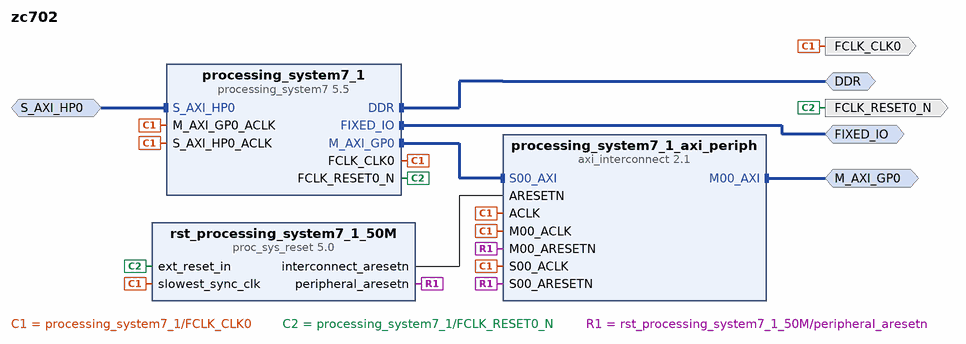
[diagram p0: block diagram of the top level]
# Vivado block design zc702, xc7z020clg484-1, Vivado 2017.2
create_bd_design zc702

create_bd_intf_port -mode Master -vlnv xilinx.com:interface:ddrx_rtl:1.0 DDR
create_bd_intf_port -mode Master -vlnv xilinx.com:display_processing_system7:fixedio_rtl:1.0 FIXED_IO
create_bd_intf_port -mode Master -vlnv xilinx.com:interface:aximm_rtl:1.0 M_AXI_GP0
set_property -dict [list \
  CONFIG.DATA_WIDTH 32 \
  CONFIG.PROTOCOL AXI4LITE \
  CONFIG.ADDR_WIDTH 32 \
  CONFIG.HAS_BURST 0 \
  CONFIG.HAS_LOCK 0 \
  CONFIG.HAS_CACHE 0 \
  CONFIG.HAS_QOS 0 \
  CONFIG.HAS_REGION 0 \
  CONFIG.NUM_READ_OUTSTANDING 8 \
  CONFIG.NUM_WRITE_OUTSTANDING 8 \
] [get_bd_intf_ports M_AXI_GP0]
create_bd_intf_port -mode Slave -vlnv xilinx.com:interface:aximm_rtl:1.0 S_AXI_HP0
set_property -dict [list \
  CONFIG.DATA_WIDTH 64 \
  CONFIG.PROTOCOL AXI3 \
  CONFIG.ID_WIDTH 6 \
  CONFIG.ADDR_WIDTH 32 \
  CONFIG.AWUSER_WIDTH 0 \
  CONFIG.ARUSER_WIDTH 0 \
  CONFIG.WUSER_WIDTH 0 \
  CONFIG.RUSER_WIDTH 0 \
  CONFIG.BUSER_WIDTH 0 \
  CONFIG.READ_WRITE_MODE READ_WRITE \
  CONFIG.HAS_BURST 1 \
  CONFIG.HAS_LOCK 1 \
  CONFIG.HAS_PROT 1 \
  CONFIG.HAS_CACHE 1 \
  CONFIG.HAS_QOS 1 \
  CONFIG.HAS_REGION 0 \
  CONFIG.HAS_WSTRB 1 \
  CONFIG.HAS_BRESP 1 \
  CONFIG.HAS_RRESP 1 \
  CONFIG.SUPPORTS_NARROW_BURST 1 \
  CONFIG.NUM_READ_OUTSTANDING 8 \
  CONFIG.NUM_WRITE_OUTSTANDING 8 \
  CONFIG.MAX_BURST_LENGTH 16 \
  CONFIG.NUM_READ_THREADS 1 \
  CONFIG.NUM_WRITE_THREADS 1 \
  CONFIG.RUSER_BITS_PER_BYTE 0 \
  CONFIG.WUSER_BITS_PER_BYTE 0 \
] [get_bd_intf_ports S_AXI_HP0]
create_bd_port -dir O -type clk FCLK_CLK0
set_property -dict {CONFIG.ASSOCIATED_BUSIF S_AXI_HP0:M_AXI_GP0} [get_bd_ports FCLK_CLK0]
create_bd_port -dir O -type rst FCLK_RESET0_N

create_bd_cell -type ip -vlnv xilinx.com:ip:processing_system7:5.5 processing_system7_1
set_property -dict [list \
  CONFIG.PCW_FPGA0_PERIPHERAL_FREQMHZ 150 \
  CONFIG.PCW_USE_S_AXI_HP0 1 \
  CONFIG.PCW_QSPI_GRP_SINGLE_SS_ENABLE 1 \
  CONFIG.PCW_TTC0_PERIPHERAL_ENABLE 1 \
  CONFIG.PCW_FCLK0_PERIPHERAL_CLKSRC {ARM PLL} \
  CONFIG.preset ZC702 \
] [get_bd_cells processing_system7_1]
# 4 more settings of processing_system7_1 are not shown: defaults, MIO pin electricals, DDR timing, and values the tool derives
create_bd_cell -type ip -vlnv xilinx.com:ip:axi_interconnect:2.1 processing_system7_1_axi_periph
set_property -dict {CONFIG.NUM_MI 1} [get_bd_cells processing_system7_1_axi_periph]
create_bd_cell -type ip -vlnv xilinx.com:ip:proc_sys_reset:5.0 rst_processing_system7_1_50M

# ---- connections ----

connect_bd_intf_net [get_bd_intf_pins processing_system7_1/M_AXI_GP0] [get_bd_intf_pins processing_system7_1_axi_periph/S00_AXI]
connect_bd_intf_net [get_bd_intf_ports DDR] [get_bd_intf_pins processing_system7_1/DDR]
connect_bd_intf_net [get_bd_intf_ports FIXED_IO] [get_bd_intf_pins processing_system7_1/FIXED_IO]
connect_bd_intf_net [get_bd_intf_ports M_AXI_GP0] [get_bd_intf_pins processing_system7_1_axi_periph/M00_AXI]
connect_bd_intf_net -intf_net S_AXI_HP0_1 [get_bd_intf_ports S_AXI_HP0] [get_bd_intf_pins processing_system7_1/S_AXI_HP0]
connect_bd_net [get_bd_pins processing_system7_1/FCLK_CLK0] \
  [get_bd_ports FCLK_CLK0] [get_bd_pins processing_system7_1/M_AXI_GP0_ACLK] \
  [get_bd_pins processing_system7_1/S_AXI_HP0_ACLK] [get_bd_pins processing_system7_1_axi_periph/ACLK] \
  [get_bd_pins processing_system7_1_axi_periph/M00_ACLK] [get_bd_pins processing_system7_1_axi_periph/S00_ACLK] \
  [get_bd_pins rst_processing_system7_1_50M/slowest_sync_clk]
connect_bd_net [get_bd_pins processing_system7_1/FCLK_RESET0_N] [get_bd_ports FCLK_RESET0_N] [get_bd_pins rst_processing_system7_1_50M/ext_reset_in]
connect_bd_net [get_bd_pins rst_processing_system7_1_50M/interconnect_aresetn] [get_bd_pins processing_system7_1_axi_periph/ARESETN]
connect_bd_net [get_bd_pins rst_processing_system7_1_50M/peripheral_aresetn] \
  [get_bd_pins processing_system7_1_axi_periph/M00_ARESETN] [get_bd_pins processing_system7_1_axi_periph/S00_ARESETN]

# ---- address map ----
assign_bd_address -offset 0x43C00000 -range 64K -target_address_space [get_bd_addr_spaces processing_system7_1/Data] [get_bd_addr_segs M_AXI_GP0/Reg]
assign_bd_address -offset 0x00000000 -range 1G -target_address_space [get_bd_addr_spaces S_AXI_HP0] [get_bd_addr_segs processing_system7_1/S_AXI_HP0/HP0_DDR_LOWOCM]

validate_bd_design
save_bd_design
